# EAGLE schematic It's Time, Do (EAGLE 9.6.2)
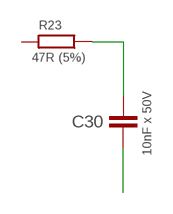
[diagram p0: schematic, sheet 1]

## Parts
C30  10nF x 50V  C_0603  [C0603]
R23  47R (5%)  R_0603  [R0603]

## Nets
0V: C30.2
N$1: C30.1 R23.1
Unconnected: R23.2

## Library data of the parts
C30 = My-RLC:C_: NON-POLARIZED CAP; PN: C0603C103M5RACTU
R23 = My-RLC:R_: RESISTOR; PN: RC0603JR-0747RL